# EAGLE design H0FR8 (EAGLE 9.6.1)

## Sheet 1 of 2
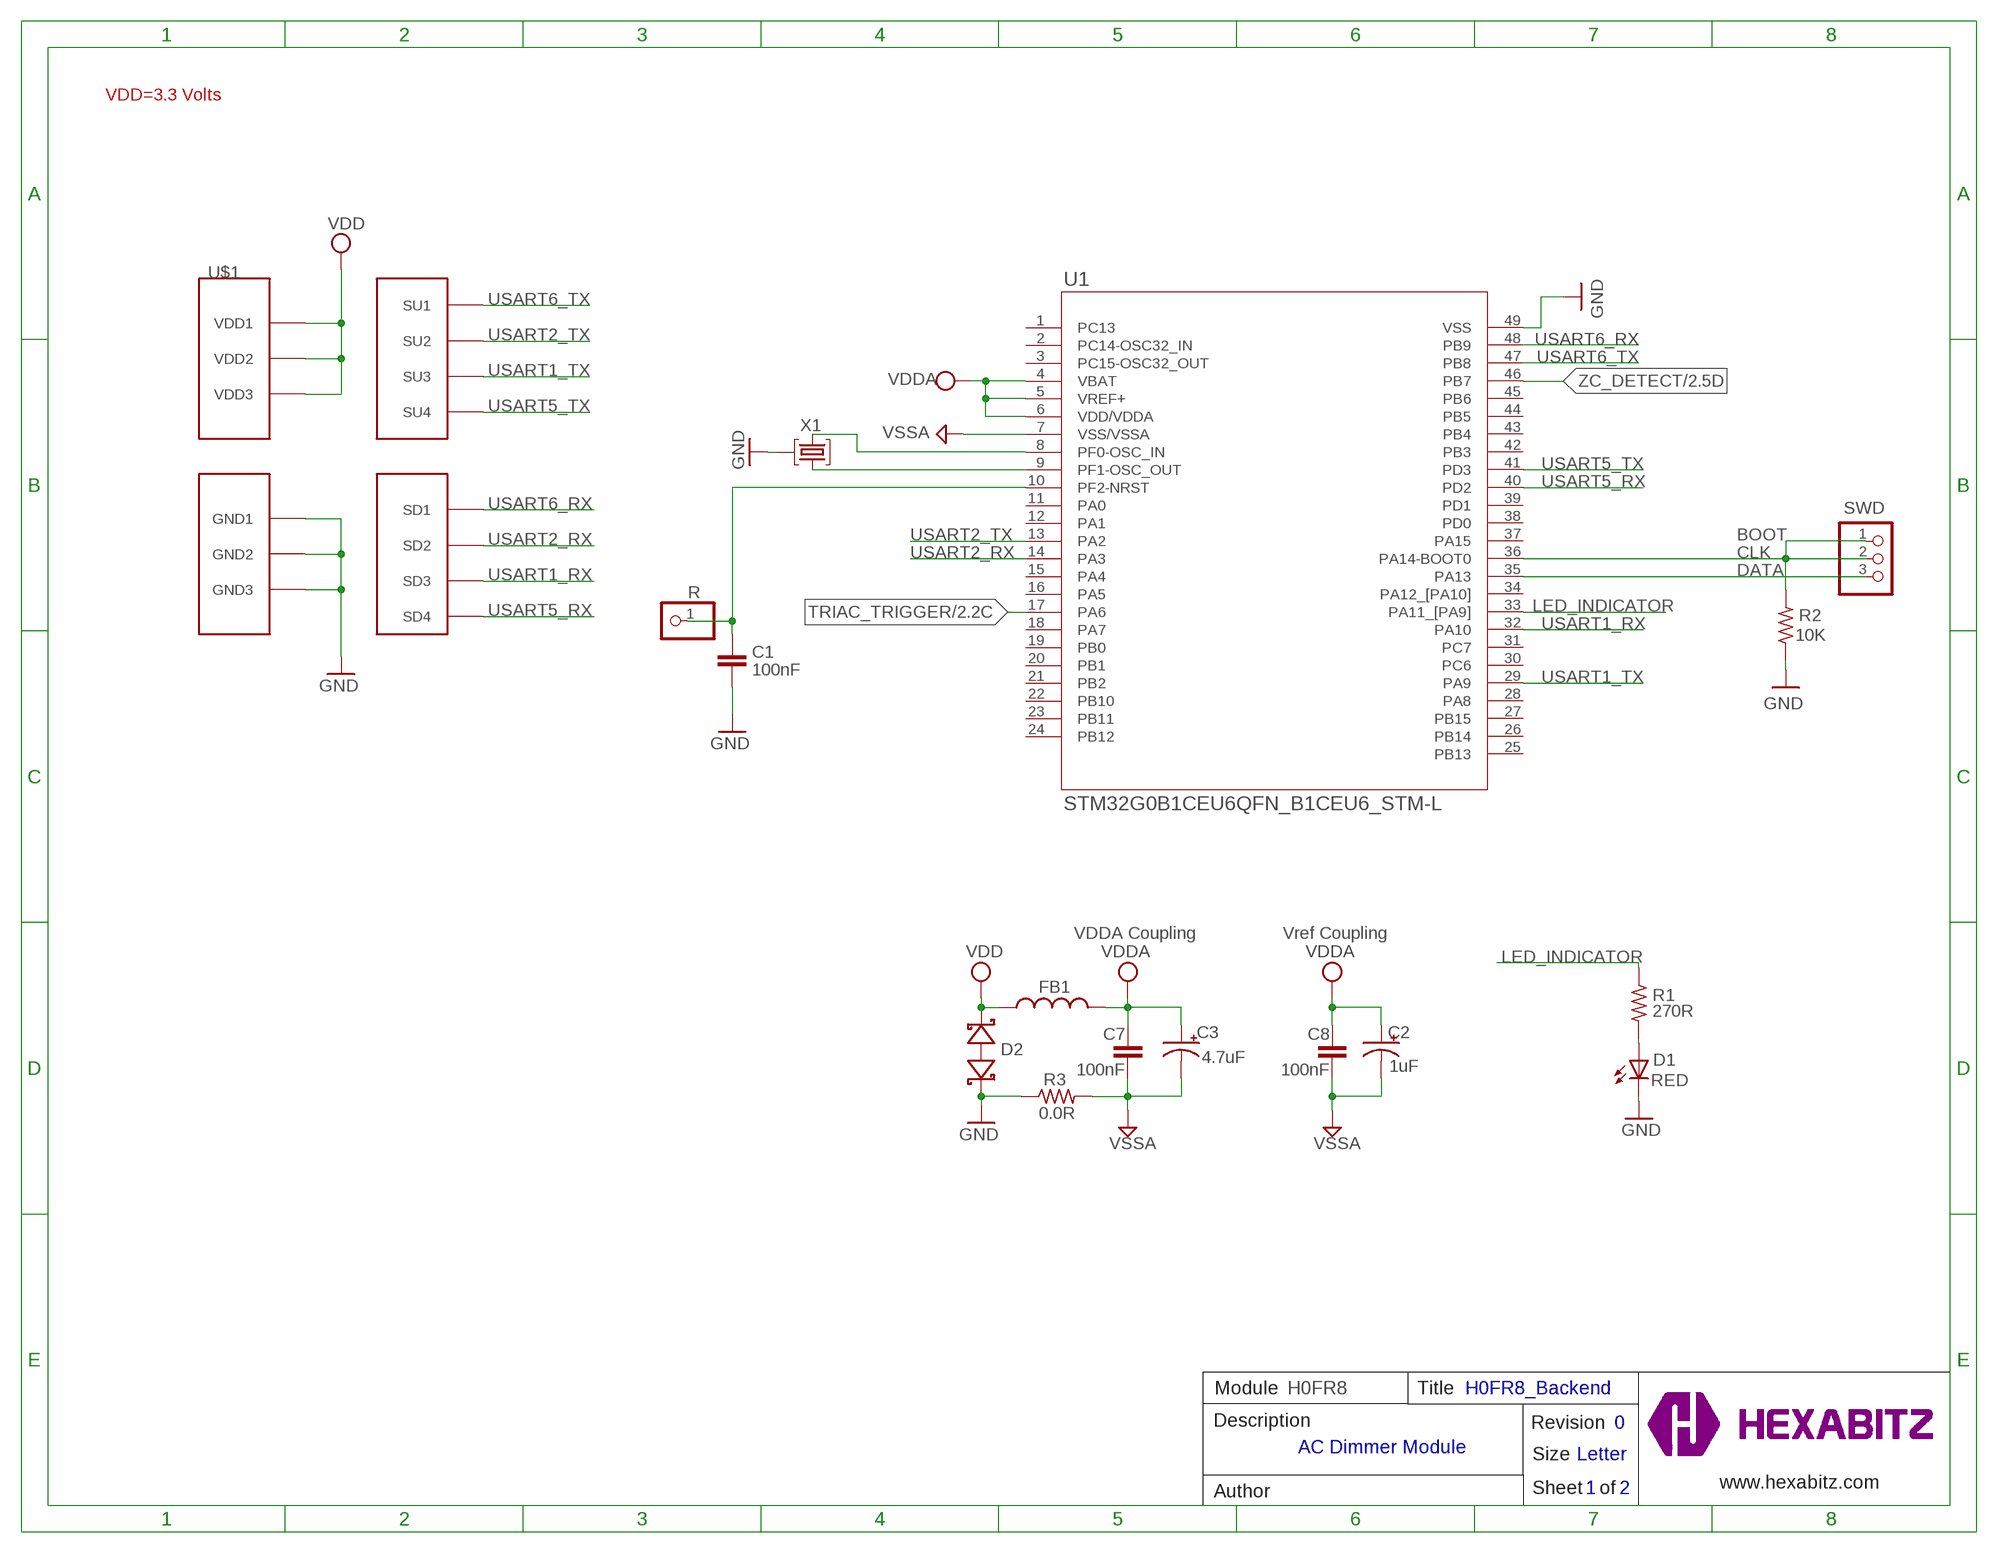
[diagram p0: schematic, sheet 1]

### Parts
C1  100nF  C-0603  [C-0603]
C2  1uF  C-0805-POL  [C-0805-POL]
C3  4.7uF  C-0805-POL  [C-0805-POL]
C7  100nF  C-0603  [C-0603]
C8  100nF  C-0603  [C-0603]
D1  RED  VLMS1300-GS08  [VLMS1300-GS08]
D2  BOURNS_CDSOD323-T03SCBOURNS_CDSOD323-T03SC_0_0  [BOURNS_CDSOD323-T03SC_0]
FB1  FB-0603  [FB-0603]
R  R  PINHD-1X1  [1X01]
R1  270R  R-0603  [R-0603]
R2  10K  R-0603  [R-0603]
R3  0.0R  R-0603  [R-0603]
SWD  PINHD-1X3  [1X03]
TRIMBLE-LOGO2  HEXA-LOGO  [HEXA-LOGO]
U1  STM32G0B1CEU6QFN_B1CEU6_STM-L  [QFN_B1CEU6_STM-L]
U$1  HEXABIT_17.32_X3_NO_P1_P2_P3_P4_P5_P6_P11_P12  [HEXABIT_17.32_X3_NO_P1_P2_P3_P4_P5_P6_P11_P12]
X1  XTALL_CSTCE8M00G52  [XTALL_CSTCE8M00G52]

### Nets
CLK: R2.2 SWD.1 SWD.2 U1.36(PA14-BOOT0)
DATA: SWD.3 U1.35(PA13)
GND: C1.2 D1.C D2.2(C) R2.1 R3.1 U1.49(VSS) U$1.PAD_PD12(GND1) U$1.PAD_PD17(GND2) U$1.PAD_PD19(GND3) X1.P$2 ; also sheet 2
LED_INDICATOR: R1.1 U1.33(PA11_[PA9])
N$1: D1.A R1.2
N$2: C1.1 R.1 U1.10(PF2-NRST)
N$5: U1.9(PF1-OSC_OUT) X1.P$1
N$6: U1.8(PF0-OSC_IN) X1.P$3
TRIAC_TRIGGER: U1.17(PA6) ; also sheet 2
USART1_RX: U1.32(PA10) U$1.PAD_PD2(SD3)
USART1_TX: U1.29(PA9) U$1.PAD_PU2(SU3)
USART2_RX: U1.14(PA3) U$1.PAD_PD1(SD2)
USART2_TX: U1.13(PA2) U$1.PAD_PU1(SU2)
USART5_RX: U1.40(PD2) U$1.PAD_PD8(SD4)
USART5_TX: U1.41(PD3) U$1.PAD_PU8(SU4)
USART6_RX: U1.48(PB9) U$1.PAD_PD3(SD1)
USART6_TX: U1.47(PB8) U$1.PAD_PU3(SU1)
VDD: D2.1(A) FB1.1 U$1.PAD_PU12(VDD1) U$1.PAD_PU17(VDD2) U$1.PAD_PU19(VDD3) ; also sheet 2
VDDA: C2.1(+) C3.1(+) C7.1 C8.1 FB1.2 U1.4(VBAT) U1.5(VREF+) U1.6(VDD/VDDA)
VSSA: C2.2(-) C3.2(-) C7.2 C8.2 R3.2 U1.7(VSS/VSSA)
ZC_DETECT: U1.46(PB7) ; also sheet 2
Unconnected: U1.1(PC13) U1.2(PC14-OSC32_IN) U1.3(PC15-OSC32_OUT) U1.11(PA0) U1.12(PA1) U1.15(PA4) U1.16(PA5) U1.18(PA7) U1.19(PB0) U1.20(PB1) U1.21(PB2) U1.22(PB10) U1.23(PB11) U1.24(PB12) U1.25(PB13) U1.26(PB14) U1.27(PB15) U1.28(PA8) U1.30(PC6) U1.31(PC7) U1.34(PA12_[PA10]) U1.37(PA15) U1.38(PD0) U1.39(PD1) U1.42(PB3) U1.43(PB4) U1.44(PB5) U1.45(PB6)

### Notes on the sheet
- VDD=3.3 Volts
- BOOT
- VDDA Coupling | Vref Coupling
- Module | H0FR8 | Title | H0FR8_Backend
- Description | Revision | 0
- AC Dimmer Module
- Size | Letter
- www.hexabitz.com
- Author | Sheet   of | 1 | 2
- C:/Users/Admin/Desktop/logodraft.bmp

## Sheet 2 of 2
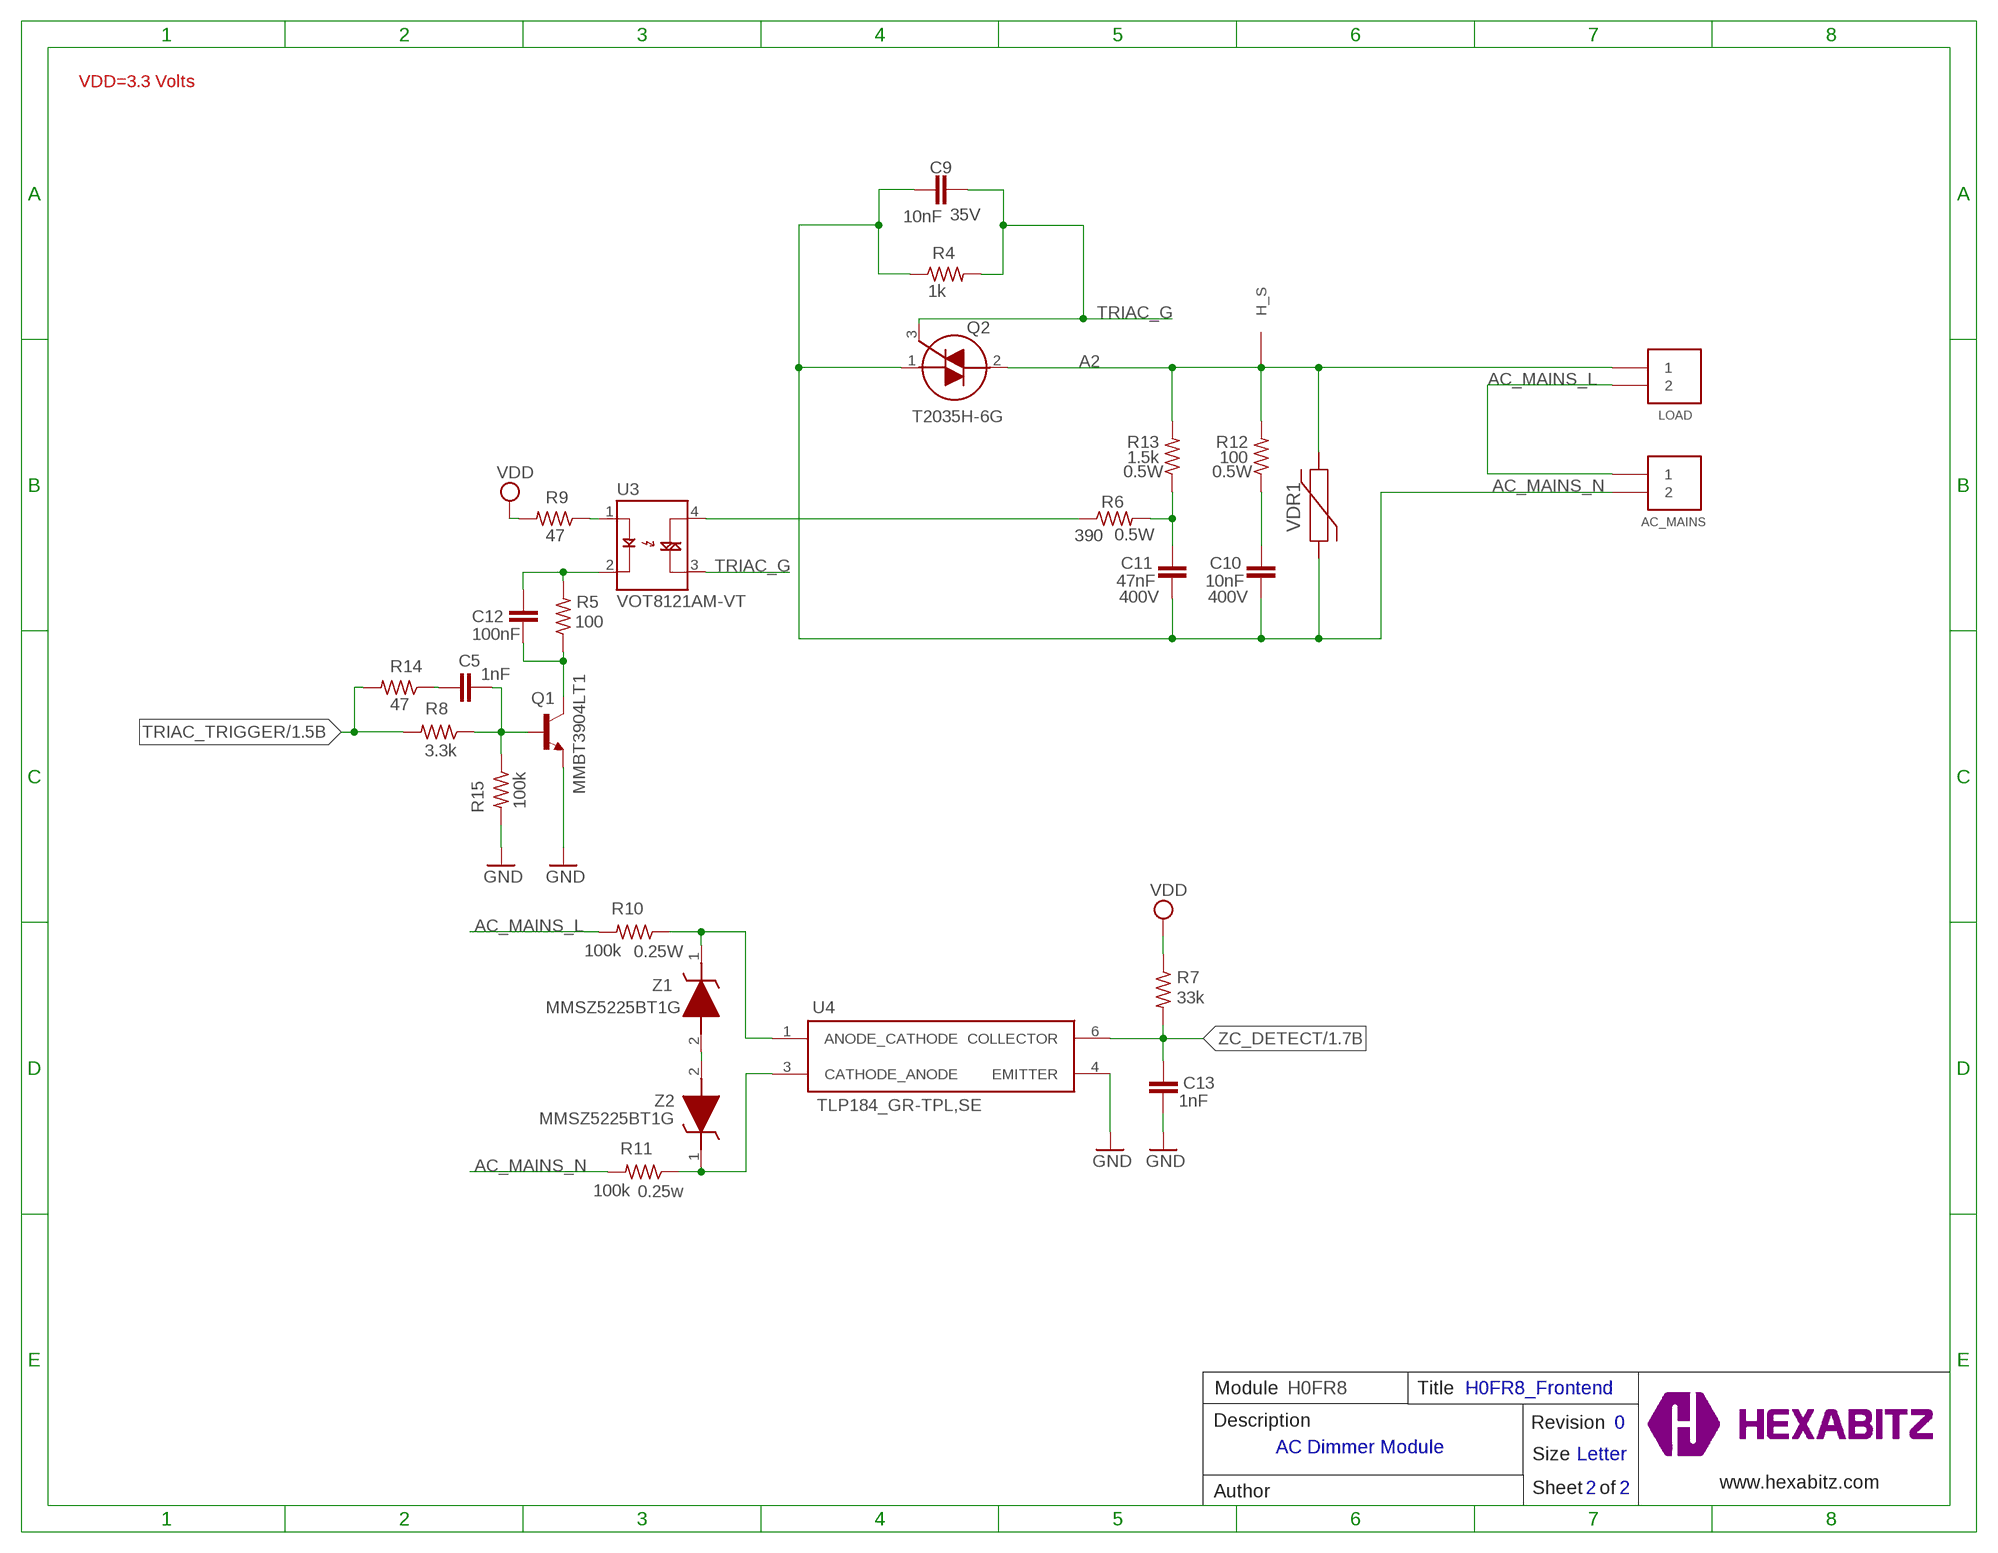
[diagram p1: schematic, sheet 2]

### Parts
AC_MAINS  1546111-2  [1546111-2]
C5  1nF  C-0603  [C-0603]
C9  10nF  C-0603  [C-0603]
C10  10nF  C-0805  [C-0805]
C11  47nF  C-0805  [C-0805]
C12  100nF  C-0603  [C-0603]
C13  1nF  C-0603  [C-0603]
LOAD  1546111-2  [1546111-2]
Q1  MMBT3904LT1  [MMBT3904LT1]
Q2  T2035H-6G  [T2035H6G]
R4  1k  R-0603  [R-0603]
R5  100  R-0603  [R-0603]
R6  390  R-0805  [R-0805]
R7  33k  R-0603  [R-0603]
R8  3.3k  R-0603  [R-0603]
R9  47  R-0603  [R-0603]
R10  100k  R-0805  [R-0805]
R11  100k  R-0805  [R-0805]
R12  100  R-0805  [R-0805]
R13  1.5k  R-0805  [R-0805]
R14  47  R-0603  [R-0603]
R15  100k  R-0603  [R-0603]
U3  VOT8121AM-VT  [SOIC254P675X240-4N]
U4  TLP184_GR-TPL,SE  [SOIC254P700X230-4N]
U$2  FK244D2PAK  [FK244D2PAK]
VDR1  V275LA4P  [LA_07MM_LOW_LTF]
Z1  MMSZ5225BT1G  [SOD3716X135N]
Z2  MMSZ5225BT1G  [SOD3716X135N]

### Nets
A2 [AC]: LOAD.1 Q2.2(MT2) R12.2 R13.2 U$2.P$1(H_S) U$2.P$2(H_S) VDR1.2
AC_MAINS_L [AC]: AC_MAINS.1 LOAD.2 R10.2
AC_MAINS_N [AC]: AC_MAINS.2 C9.2 C10.2 C11.2 Q2.1(MT1) R4.1 R11.2 VDR1.1
GND: C13.2 Q1.2(E) R15.2 U4.4(EMITTER) ; also sheet 1
N$3: R9.1 U3.1(A)
N$4: C10.1 R12.1
N$7: C11.1 R6.2 R13.1
N$8: R6.1 U3.4(MT2)
N$9: C5.2 R14.1
N$10: C12.1 R5.2 U3.2(C)
N$11: C12.2 Q1.3(C) R5.1
N$12: Z1.2(A) Z2.2(A)
N$13: C5.1 Q1.1(B) R8.1 R15.1
N$15: R10.1 U4.1(ANODE_CATHODE) Z1.1(K)
N$16: R11.1 U4.3(CATHODE_ANODE) Z2.1(K)
TRIAC_G: C9.1 Q2.3(G) R4.2 U3.3(MT1)
TRIAC_TRIGGER: R8.2 R14.2 ; also sheet 1
VDD: R7.1 R9.2 ; also sheet 1
ZC_DETECT: C13.1 R7.2 U4.6(COLLECTOR) ; also sheet 1

### Notes on the sheet
- VDD=3.3 Volts
- Module | H0FR8 | Title | H0FR8_Frontend
- Description | Revision | 0
- AC Dimmer Module
- Size | Letter
- www.hexabitz.com
- Author | Sheet   of | 2 | 2

## Library data of the parts
AC_MAINS LOAD = HEXABITZ_CONNECTION_PARTS:1546111-2: Conn Shrouded Header HDR 2 POS 5.08mm Solder ST Thru-Hole; MFN: TE Connectivity; MPN: 1546111-2; OCTOPART_URL: https://octopart.com/1546111-2-te+connectivity-40393355
C1 C5 C7 C8 C12 C13 = HEXABITZ_RCLS:C-0603: CAP CER 10% X7R 0603
C2 = HEXABITZ_RCLS:C-0805-POL: Cap Tant Solid SMD 2012; CAPACITANCE: 1.00uF; MFN: Yageo; MPN: CC0805KKX7R7BB105; OCTOPART_URL: https://octopart.com/cc0805kkx7r7bb105-yageo-8376555?r=sp&s=YKl1wwtkROau_X5nniH2ig; TOLERANCE: 10%; VOLTAGE_RATING: 16V
C3 = HEXABITZ_RCLS:C-0805-POL: Cap Tant Solid SMD 2012; CAPACITANCE: 4.7uF; MFN: Murata; MPN: GRM21BC81E475KA12L; OCTOPART_URL: https://octopart.com/grm21bc81e475ka12l-murata-10331911?r=sp&s=RY3qZSD8T6mG6TC9CHI5qQ; TOLERANCE: 10%; VOLTAGE_RATING: 25V
C9 = HEXABITZ_RCLS:C-0603: CAP CER 10% X7R 0603; VOLTAGE_RATING: 35V
C10 = HEXABITZ_RCLS:C-0805: CAP CER 10% X7R 0805; MPN: C2012X7T2W103M085AA; VOLTAGE_RATING: 400V
C11 = HEXABITZ_RCLS:C-0805: CAP CER 10% X7R 0805; MPN: C2012X7T2W473K125AA; VOLTAGE_RATING: 400V
D1 = HEXABITZ_USER_INTERFACE_PARTS:VLMS1300-GS08: Red 0603 130° Clear 54 mcd 2 V Surface Mount ChipLED ; Octopart Url : http://octopart.com/vlms1300-gs08-vishay-21709201; MFN: Vishay; MPN: VLMS1300-GS08; OCTOPART_URL: https://octopart.com/vlms1300-gs08-vishay-21709201?r=sp&s=_gcP4_q8T1SC6PJQPTQ9yA
D2 = HEXABITZ_RCLS:BOURNS_CDSOD323-T03SC: CDSOD323-TxxSC - TVS Diode Series; DESCRIPTION: Dio Tvs Vwm 03V 500W Bidir Sod323 / Tape & Reel - 7" Reel; MFN: Bourns; MPN: CDSOD323-T03SC; OCTOPART_URL: https://octopart.com/cdsod323-t03sc-bourns-10487153?r=sp
FB1 = HEXABITZ_RCLS:FB-0603: Ferrite Beads Multi-Layer 0603
Q1 = HEXABITZ_RCLS:MMBT3904LT1: TRANS NPN 40V 0.2A SOT23; MFN: ON Semiconductor; MOUNTING_STYLE: Surface Mount; MPN: MMBT3904LT1G; NUM_OF_PINS: 3; OCTOPART_ID: 0bb6c2bc2200d471; OCTOPART_URL: http://octopart.com/mmbt3904lt1g-on+semiconductor-3280; PACKAGE: SOT-23-3; PACKAGING: Reel; POLARITY: NPN; POWER_DISSIPATION: 0.225 W; PRODUCT_CATEGORY: Transistors Bipolar-BJT; SERIES: MMBT3904L; VOLTAGE_RATING_DC: 40.0 V
Q2 = HEXABITZ_ICs:T2035H-6G: TRIAC 600V 210A 3-Pin(2+Tab) D2PAK Tube Source: Datasheet <https://www.st.com/resource/en/datasheet/t2035h-6g.pdf>; DESCRIPTION: TRIAC 600V 210A 3-Pin(2+Tab) D2PAK Tube; HEIGHT: 4.83mm; MANUFACTURER_NAME: STMicroelectronics; MANUFACTURER_PART_NUMBER: T2035H-6G; MOUSER_PART_NUMBER: 511-T2035H-6G; MOUSER_PRICE-STOCK: https://www.mouser.co.uk/ProductDetail/STMicroelectronics/T2035H-6G?qs=gNDSiZmRJS8hxiVy%2FAHP7g%3D%3D
R = HEXABITZ_USER_INTERFACE_PARTS:PINHD-1X1: PIN HEADER; MFN: TE Connectivity; MPN: 87227-1; OCTOPART_URL: https://octopart.com/87227-1-te+connectivity-39512052?r=sp
R1-R4 = HEXABITZ_RCLS:R-0603: Thick Film Resistors - SMD 0603
R5 R7 R9 R14 = HEXABITZ_RCLS:R-0603: Thick Film Resistors - SMD 0603; MFN: Yageo; MPN: RC0402FR-07100RL; OCTOPART_URL: https://octopart.com/crcw0603110rfkea-vishay-39455532; RESISTANCE: 110.0 Ω; TOLERANCE: ±1%
R6 = HEXABITZ_RCLS:R-0805: Thick Film Resistors - SMD 0605; MPN: ERJ-P06J391V; POWER: 0.5W
R8 R15 = HEXABITZ_RCLS:R-0603: Thick Film Resistors - SMD 0603; MFN: Yageo; MPN: RC0603JR-070RL; OCTOPART_URL: https://octopart.com/crcw06032k40jnea-vishay-40298967; RESISTANCE: 2400.0 Ω; TOLERANCE: ±5%
R10 = HEXABITZ_RCLS:R-0805: Thick Film Resistors - SMD 0605; MFN: Yageo; MPN: RC0603JR-070RL; OCTOPART_URL: https://octopart.com/crcw06032k40jnea-vishay-40298967; POWER: 0.25W; RESISTANCE: 2400.0 Ω; TOLERANCE: ±5%
R11 = HEXABITZ_RCLS:R-0805: Thick Film Resistors - SMD 0605; MPN: ERJ-P06J104V; POWER: 0.25w
R12 = HEXABITZ_RCLS:R-0805: Thick Film Resistors - SMD 0605; MPN: ERJ-P06J101V; POWER: 0.5W
R13 = HEXABITZ_RCLS:R-0805: Thick Film Resistors - SMD 0605; MPN: ERJ-P06J152V; POWER: 0.5W
SWD = HEXABITZ_CONNECTION_PARTS:PINHD-1X3: PIN HEADER
TRIMBLE-LOGO2 = HEXABITZ_USER_INTERFACE_PARTS:HEXA-LOGO: Trimble-Logo
U1 = HEXABITZ_ICs:STM32G0B1CEU6; COPYRIGHT: Copyright (C) 2021 Ultra Librarian. All rights reserved.; MANUFACTURER_PART_NUMBER: STM32G0B1CEU6; MFR_NAME: STMicroelectronics
U3 = HEXABITZ_ICs:VOT8121AM-VT: VOT8121AM-VT Check availability <https://pricing.snapeda.com/parts/VOT8121AM-VT/Vishay%20Semiconductor%20Opto%20Division/view-part?ref=eda>; AVAILABILITY: In Stock; CHECK_PRICES: https://www.snapeda.com/parts/VOT8121AM-VT/Vishay+Semiconductor+Opto+Division/view-part/?ref=eda; DESCRIPTION: Optoisolator Triac Output 3750Vrms 1 Channel 4-SOP; MF: Vishay Semiconductor Opto Division; MP: VOT8121AM-VT; PACKAGE: SMD-4 Vishay Semiconductor Opto Division; PRICE: None; SNAPEDA_LINK: https://www.snapeda.com/parts/VOT8121AM-VT/Vishay+Semiconductor+Opto+Division/view-part/?ref=snap
U4 = HEXABITZ_ICs:TLP184_GR-TPL,SE: Transistor Output Optocouplers 50mA Photocoupler 80V 50mA 3750Vrms Source: Datasheet <https://toshiba.semicon-storage.com/info/docget.jsp?did=14118&prodName=TLP184(SE>
U$1 = hexabitz_connectors:HEXABIT_17.32_X3_NO_P1_P2_P3_P4_P5_P6_P11_P12
U$2 = HEXABITZ_OTHER_PARTS:FK244D2PAK
VDR1 = HEXABITZ_RCLS:V275LA4P; COPYRIGHT: Copyright (C) 2024 Ultra Librarian. All rights reserved.; MANUFACTURER_PART_NUMBER: V275LA4P; MFR_NAME: Littelfuse Inc
X1 = Hexabitz:XTALL_CSTCE8M00G52: MURATA CSTCE8M00G52-R0 RESONATOR, SMD, 8MHZ ; Octopart Url : https://octopart.com/cstce8m00g52-r0-murata-7145559; MFN: Murata; MPN: CSTCE8M00G52Z-R0; OCTOPART_URL: https://octopart.com/cstce8m00g52z-r0-murata-17755941?r=sp&s=JDnNJnrHQhyS8Zk4ofFWXw
Z1 Z2 = HEXABITZ_RCLS:MMSZ5225BT1G: Zener Diode 500 mW SOD-123 Source: Datasheet <http://www.onsemi.com/pub/Collateral/MMSZ5221BT1-D.PDF>; ARROW_PART_NUMBER: MMSZ5225BT1G; ARROW_PRICE-STOCK: https://www.arrow.com/en/products/mmsz5225bt1g/on-semiconductor?region=nac; DESCRIPTION: Zener Diode 500 mW SOD-123; HEIGHT: 1.35mm; MANUFACTURER_NAME: onsemi; MANUFACTURER_PART_NUMBER: MMSZ5225BT1G; MOUSER_PART_NUMBER: 863-MMSZ5225BT1G; MOUSER_PRICE-STOCK: https://www.mouser.co.uk/ProductDetail/onsemi/MMSZ5225BT1G?qs=P4IOph%252Bbot9HKjr%2F4KMXOA%3D%3D

## Net classes
1 AC: clearance 1.016 mm

## Board
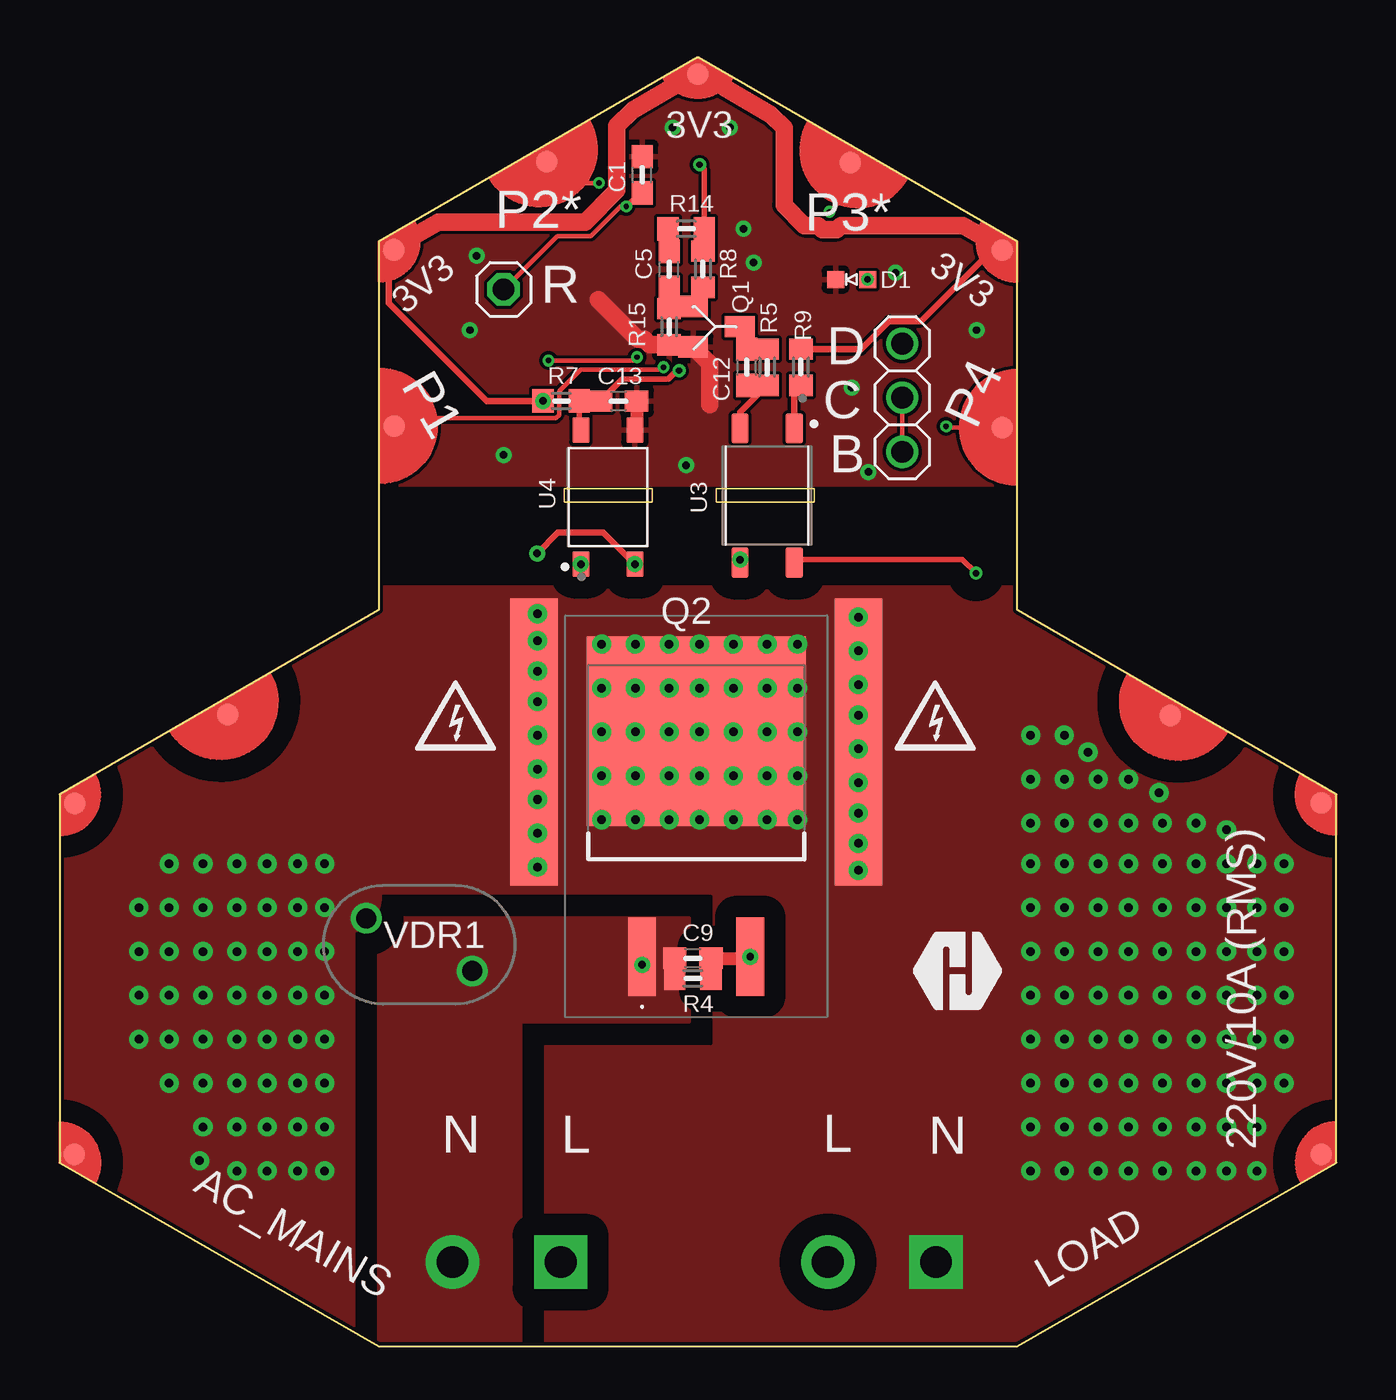
[diagram p2: board, top side]
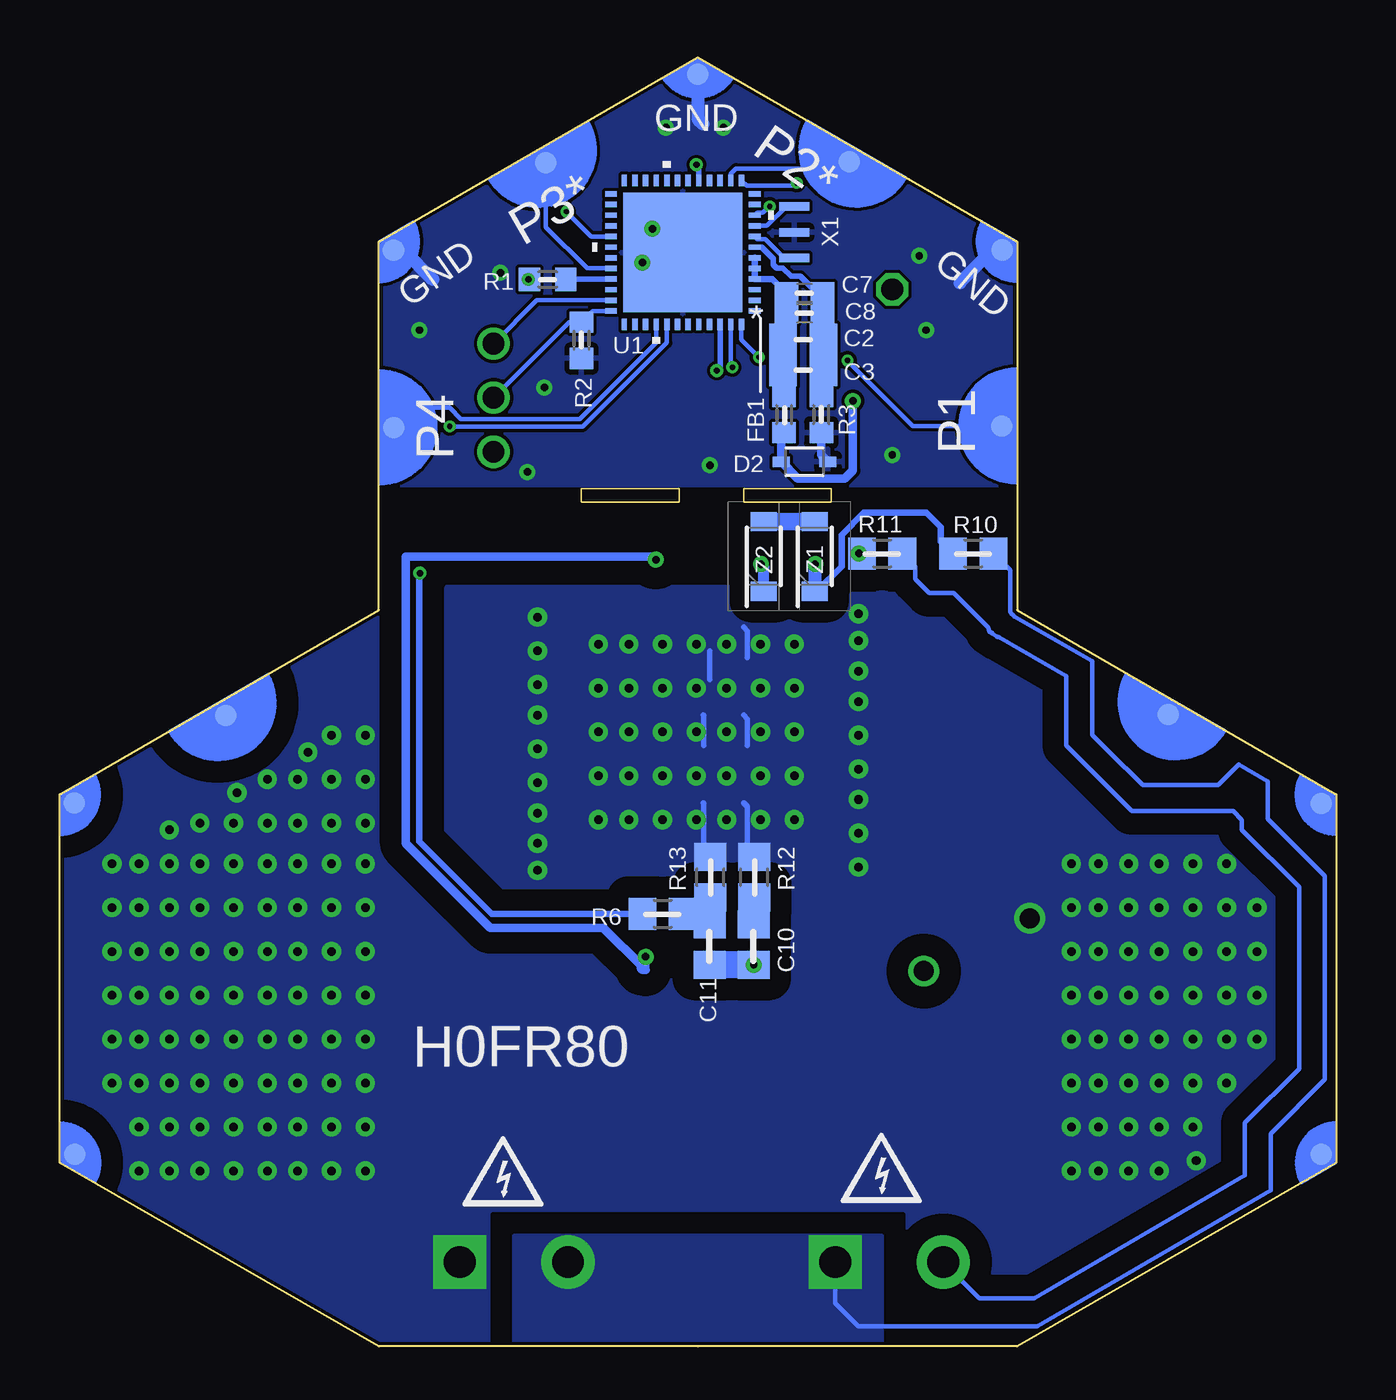
[diagram p3: board, bottom side, seen from below]

Size 60 x 60.6 mm. Coordinates in mm from the lower left corner, seen from the top.
Copper layers (1*16): Top 0.035mm / dielectric 1.5mm / Bottom 0.035mm
Design rules "2_layer *": minimum track width 7mil, minimum drill 0.2mm, track to track 6mil, track to pad 6mil, pad to pad 6mil, via to via 6mil, smd to smd 0mil, copper to edge 0.15mm, drill to drill 8mil, minimum pad ring 10mil, minimum via ring 6mil, stop-mask expansion 2mil, vias tented up to drill 16mil, thermal gap 10mil
Milling: 8 lines

### Footprints (pad centres in the part's own frame; a part is rotated, then mirrored left to right if it is on the bottom)
1546111-2 = drill 1.5 pad 2.5 square: 1 -2.54,0 | drill 1.5 pad 2.5: 2 2.54,0
C-0603 = smd 1.1 x 1: 1 -0.85,0; 2 0.85,0
C-0805-POL = smd 1.3 x 1.5: 1 -0.95,0; 2 0.95,0
C-0805 = smd 1.3 x 1.5: 1 -0.95,0; 2 0.95,0
VLMS1300-GS08 = smd 0.8 x 0.8: A 0,0.75; C 0,-0.75
BOURNS_CDSOD323-T03SC_0 = smd 0.8 x 0.5: 1 -1.1,0; 2 1.1,0
FB-0603 = smd 1 x 1.1: 1 -0.85,0; 2 0.85,0
MMBT3904LT1 = smd 1 x 1.4: 1 -0.95,-1.1; 2 0.95,-1.1; 3 0,1.1
T2035H6G = smd 3.7 x 1.3: 1 6.6,-2.54; 3 6.6,2.54 | smd 8.9 x 10.3: 2 -4,0
1X01 = drill 1.016 octagon: 1 0,0
R-0603 = smd 1 x 1.1: 1 -0.85,0; 2 0.85,0
R-0805 = smd 1.3 x 1.5: 1 -0.95,0; 2 0.95,0
1X03 = drill 1.016: 1 -2.54,0; 2 0,0; 3 2.54,0
QFN_B1CEU6_STM-L = smd 0.55 x 0.254: 1 -3.38,2.751; 2 -3.38,2.251; 3 -3.38,1.75; 4 -3.38,1.25; 5 -3.38,0.75; 6 -3.38,0.25; 7 -3.38,-0.25; 8 -3.38,-0.75; 9 -3.38,-1.25; 10 -3.38,-1.75; 11 -3.38,-2.251; 12 -3.38,-2.751; 25 3.38,-2.751; 26 3.38,-2.251; 27 3.38,-1.75; 28 3.38,-1.25; 29 3.38,-0.75; 30 3.38,-0.25; 31 3.38,0.25; 32 3.38,0.75; 33 3.38,1.25; 34 3.38,1.75; 35 3.38,2.251; 36 3.38,2.751 | smd 0.254 x 0.55: 13 -2.751,-3.38; 14 -2.251,-3.38; 15 -1.75,-3.38; 16 -1.25,-3.38; 17 -0.75,-3.38; 18 -0.25,-3.38; 19 0.25,-3.38; 20 0.75,-3.38; 21 1.25,-3.38; 22 1.75,-3.38; 23 2.251,-3.38; 24 2.751,-3.38; 37 2.751,3.38; 38 2.251,3.38; 39 1.75,3.38; 40 1.25,3.38; 41 0.75,3.38; 42 0.25,3.38; 43 -0.25,3.38; 44 -0.75,3.38; 45 -1.25,3.38; 46 -1.75,3.38; 47 -2.251,3.38; 48 -2.751,3.38 | smd 5.6 x 5.6: 49 0,0
SOIC254P675X240-4N = smd 1.4 x 0.8: 1 -3.15,1.27; 2 -3.15,-1.27; 3 3.15,-1.27; 4 3.15,1.27
SOIC254P700X230-4N = smd 1.2 x 0.8: 1 -3.15,1.27; 3 -3.15,-1.27; 4 3.15,-1.27; 6 3.15,1.27
HEXABIT_17.32_X3_NO_P1_P2_P3_P4_P5_P6_P11_P12 = smd 1 x 1 bottom: PAD_PD1 -6.86,25.69; PAD_PD2 7.39,25.65; PAD_PD6 -21.865,-0.296; PAD_PD12 0.24,29.8 | smd 1 x 1 rotated 150 bottom: PAD_PD3 -14.037,13.278; PAD_PD5 -29.057,-4.464; PAD_PD8 14.542,13.204 | smd 1 x 1 rotated 30 bottom: PAD_PD7 -29.06,-20.97; PAD_PD13 22.432,-0.341 | smd 1 x 1 rotated 330 bottom: PAD_PD9 29.539,-20.961; PAD_PD17 -14.056,21.551 | smd 1 x 1 rotated 210 bottom: PAD_PD11 29.543,-4.456; PAD_PD19 14.55,21.537 | smd 1 x 1: PAD_PU1 -6.86,25.69; PAD_PU2 7.39,25.65; PAD_PU6 -21.865,-0.296; PAD_PU12 0.24,29.8 | smd 1 x 1 rotated 150: PAD_PU3 -14.037,13.278; PAD_PU5 -29.057,-4.464; PAD_PU8 14.542,13.204 | smd 1 x 1 rotated 30: PAD_PU7 -29.06,-20.97; PAD_PU13 22.432,-0.341 | smd 1 x 1 rotated 330: PAD_PU9 29.539,-20.961; PAD_PU17 -14.056,21.551 | smd 1 x 1 rotated 210: PAD_PU11 29.543,-4.456; PAD_PU19 14.55,21.537
FK244D2PAK = smd 2.25 x 13.5: P$1 0,0; P$2 15.25,0
LA_07MM_LOW_LTF = drill 0.94 pad 1.448: 1 -2.489,1.245; 2 2.489,-1.245
XTALL_CSTCE8M00G52 = smd 1.4 x 0.4: P$1 0,1.2; P$2 0,0; P$3 0,-1.2
SOD3716X135N = smd 0.91 x 1.22: 1 -1.635,0; 2 1.635,0

### Placement (x,y rotation side)
AC_MAINS  21.01,3.96 180 top
C1  27.38,55.08 90 top
C2  25.05,47.32 0 bottom
C3  25.05,45.89 0 bottom
C5  28.65,50.63 90 top
C7  25,49.52 0 bottom
C8  25,48.57 0 bottom
C9  29.76,18.25 180 top
C10  27.38,18.88 270 bottom
C11  29.44,18.88 270 bottom
C12  32.3,46.03 90 top
C13  26.27,44.44 0 top
D1  37.22,50.16 270 top
D2  25,41.58 0 bottom
FB1  25.95,43.81 90 bottom
LOAD  38.65,3.96 180 top
Q1  30.87,47.93 270 top
Q2  29.92,24.92 270 top
R  20.87,49.68 0 top
R1  37.06,50.16 180 bottom
R2  35.48,47.3 90 bottom
R3  24.2,43.81 90 bottom
R4  29.76,17.3 0 top
R5  33.25,46.03 270 top
R6  31.66,20.33 0 bottom
R7  23.57,44.44 0 top
R8  30.24,50.63 90 top
R9  34.84,46.03 90 top
R10  17.06,37.28 0 bottom
R11  21.35,37.28 0 bottom
R12  27.36,22.06 90 bottom
R13  29.42,22.06 90 bottom
R14  29.44,52.54 0 top
R15  28.65,47.93 270 top
SWD  39.6,44.6 90 top
TRIMBLE-LOGO2  42.21,15.8 0 top
U1  30.71,51.43 180 bottom
U3  33.25,40 270 top
U4  25.77,39.92 90 top
U$1  29.76,30 0 top
U$2  22.3,28.41 0 top
VDR1  16.9,18.88 180 top
X1  25.47,52.38 0 bottom
Z1  24.52,37.14 90 bottom
Z2  26.9,37.14 90 bottom

### Tracks (layer width: path | path; a pad name or v marks a point on that pad's centre or on a via)
A2  (via drill 0.4 pad 0.9)
  Bottom 0.254: R13.2 29.74,23.32 29.74,25.53 29.76,25.55 | R12.2 27.67,23.32 27.67,25.37 27.85,25.55 | 29.74,28.24 29.74,29.66 29.76,29.68 | 27.67,28.24 27.67,29.5 27.85,29.68 | 29.44,31.34 29.44,32.69 | 27.67,32.37 27.67,33.62 27.85,33.81
  other vias: 37.54,34.28 37.54,32.69 37.54,31.11 37.54,29.68 37.54,28.09 37.54,26.5 37.54,25.07 37.54,23.65 37.54,22.38 22.46,22.53 22.46,24.12 22.46,25.71 22.46,27.14 22.46,28.73 22.46,30.31 22.46,31.74 22.46,33.17 22.46,34.44 45.64,22.69 47.22,22.69 48.81,22.69 50.24,22.69 51.83,22.69 53.41,22.69 54.84,22.69 56.27,22.69 57.54,22.69 45.64,20.63 47.22,20.63 48.81,20.63 50.24,20.63 51.83,20.63 53.41,20.63 54.84,20.63 56.27,20.63 57.54,20.63 45.64,18.57 47.22,18.57 48.81,18.57 50.24,18.57 51.83,18.57 53.41,18.57 54.84,18.57 56.27,18.57 57.54,18.57 45.64,16.5 47.22,16.5 48.81,16.5 50.24,16.5 51.83,16.5 53.41,16.5 54.84,16.5 56.27,16.5 57.54,16.5 45.64,14.44 47.22,14.44 48.81,14.44 50.24,14.44 51.83,14.44 53.41,14.44 54.84,14.44 56.27,14.44 57.54,14.44 45.64,12.37 47.22,12.37 48.81,12.37 50.24,12.37 51.83,12.37 53.41,12.37 54.84,12.37 56.27,12.37 57.54,12.37 45.64,10.31 47.22,10.31 48.81,10.31 50.24,10.31 51.83,10.31 53.41,10.31 54.84,10.31 56.27,10.31 45.64,8.25 47.22,8.25 48.81,8.25 50.24,8.25 51.83,8.25 53.41,8.25 54.84,8.25 56.27,8.25 45.64,28.73 47.22,28.73 45.64,26.66 47.22,26.66 48.81,26.66 50.24,26.66 45.64,24.6 47.22,24.6 48.81,24.6 50.24,24.6 51.83,24.6 53.41,24.6 54.84,24.28 51.67,26.03 48.33,27.93 25.47,26.82 27.06,26.82 28.65,26.82 30.08,26.82 31.67,26.82 33.25,26.82 34.68,26.82 25.47,24.76 27.06,24.76 28.65,24.76 30.08,24.76 31.67,24.76 33.25,24.76 34.68,24.76 25.47,30.95 27.06,30.95 28.65,30.95 30.08,30.95 31.67,30.95 33.25,30.95 34.68,30.95 25.47,28.88 27.06,28.88 28.65,28.88 30.08,28.88 31.67,28.88 33.25,28.88 34.68,28.88 25.47,33.01 27.06,33.01 28.65,33.01 30.08,33.01 31.67,33.01 33.25,33.01 34.68,33.01 5.15,22.69 6.74,22.69 8.33,22.69 9.76,22.69 11.19,22.69 12.46,22.69 3.73,20.63 5.15,20.63 6.74,20.63 8.33,20.63 9.76,20.63 11.19,20.63 12.46,20.63 3.73,18.57 5.15,18.57 6.74,18.57 8.33,18.57 9.76,18.57 11.19,18.57 12.46,18.57 3.73,16.5 5.15,16.5 6.74,16.5 8.33,16.5 9.76,16.5 11.19,16.5 12.46,16.5 3.73,14.44 5.15,14.44 6.74,14.44 8.33,14.44 9.76,14.44 11.19,14.44 12.46,14.44 5.15,12.37 6.74,12.37 8.33,12.37 9.76,12.37 11.19,12.37 12.46,12.37 6.74,10.31 8.33,10.31 9.76,10.31 11.19,10.31 12.46,10.31 6.58,8.72 8.33,8.25 9.76,8.25 11.19,8.25 12.46,8.25
  pour Bottom (rank 2, no thermals): 15,35.71 45,35.71 59.92,26.03 60.08,5.55 45.64,-3.02 5.15,-2.87 -7.55,12.69 -3.74,32.54
  pour Top (rank 2, no thermals): 15,35.71 45,35.71 59.92,26.03 60.08,5.55 45.64,-3.02 5.15,-2.87 -7.55,12.69 -3.74,32.54
AC_MAINS_L
  Bottom 0.203: R10.2 15.32,36.49 15.32,34.51 15.27,34.46 15.26,34.42 15.19,34.38 15.13,34.31 11.48,32.21 11.48,28.75 9.92,27.19 9.89,27.19 9.09,26.38 5.54,26.38 4.58,27.35 3.21,26.56 3.21,24.79 0.53,22.1 0.53,12.55 3.09,9.99 3.09,7.33 14.04,0.94 22.46,0.94 23.55,2.03 AC_MAINS.1
  pour Bottom (no thermals): 21.35,5.23 21.35,-0.01 38.65,-0.01 38.65,5.23
AC_MAINS_N  (via drill 0.35 pad 0.75)
  Top 1.27: C10.2 Q2.1
  Bottom 0.203: 12.7,31.5 12.7,28.24 9.62,25.16 4.84,25.16 4.43,24.76 4.43,24.28 1.75,21.6 1.75,13.05 4.31,10.5 4.31,8.03 14.19,2.27 16.77,2.27 AC_MAINS.2 | 12.7,31.5 | 12.7,31.5 15.87,33.34 15.91,33.34 15.95,33.38 16.17,33.51 16.18,33.54 16.31,33.61 16.35,33.78 17.98,35.41 19.13,35.41 19.78,36.06 19.78,36.66 R11.2
  Bottom 1.27: C10.2 C11.2
  other vias: 27.38,17.93
  pour Top (no thermals): 29.6,20.15 29.6,15.23 21.66,15.23 21.66,-0.01 15,-0.01 15,20.15
CLK
  Top 0.203: SWD.2 SWD.1
  Bottom 0.203: U1.36 34.95,48.68 R2.2 36.05,48.15 SWD.2
DATA
  Bottom 0.203: SWD.3 37.57,49.18 U1.35
GND  (via drill 0.35 pad 0.75)
  Top 0.61: C13.2 27.12,43.15 U4.4
  Top 0.813: 25.31,49.2 27.18,47.34 27.48,47.34 27.74,47.08 R15.2 28.75,46.98 Q1.2 30.55,46.2 30.55,44.28
  Bottom 0.305: U1.49 31.82,52.54 v32.14,52.54
  Bottom 0.406: D2.2 24.2,41.89 R3.1
  Bottom 0.61: U$1.PAD_PD12 30,57.7 29.76,57.46 | U$1.PAD_PD17 16.15,51.55 17.69,50 | U$1.PAD_PD19 43.84,51.53 42.46,50.16
  other vias: 32.62,50.95 39.29,50.47 43.09,47.78 19.28,47.78 19.6,51.27 20.87,41.9 29.44,41.43 38.02,41.11 37.22,45.08 28.81,57.3 31.51,57.3
  pour Top: 15,51.9 29.92,60.48 45,51.9 45,40.47 15,40.47
  pour Bottom: 15,51.9 29.92,60.48 45,51.9 45,40.47 15,40.47
LED_INDICATOR
  Bottom 0.254: U1.33 36.19,50.18 R1.1
N$1  (via drill 0.3 pad 0.6)
  Bottom 0.254: D1.A R1.2
  other vias: 37.97,50.16
N$2  (via drill 0.25 pad 0.55)
  Top 0.203: C1.1 27.26,54.23 v26.63,53.59 26.37,53.59 24.97,52.2 23.38,52.2 R.1
  Bottom 0.203: U1.10 27.21,53.3 26.95,53.3 26.66,53.59 v26.63,53.59
N$3
  Top 0.305: R9.1 34.52,44.86 U3.1 34.52,43.01
N$4
  Bottom 0.254: C10.1 27.36,19.86 R12.1
N$5
  Bottom 0.203: X1.P$1 25.86,53.58 26.76,52.68 U1.9
N$6
  Bottom 0.203: U1.8 27.21,52.06 26.84,52.06 25.96,51.18 X1.P$3
N$7
  Bottom 0.254: R13.1 29.44,21.08 29.44,19.99 | 29.44,19.99 C11.1 | R6.2 30.37,19.99 29.44,19.99
N$8  (via drill 0.3 pad 0.6)
  Top 0.254: 34.52,36.99 42.43,36.99 v43.07,36.35
  Top 0.61: U3.4 34.52,36.99
  Bottom 0.254: 43.09,36.32 v43.07,36.35
  Bottom 0.305: R6.1 39.7,20.33 43.09,23.73 43.09,36.32
N$9
  Top 0.305: R14.1 28.59,51.54 C5.2
N$10
  Top 0.305: 31.98,43.01 31.98,43.91 R5.2 C12.1
  Top 0.61: U3.2 31.98,43.01
N$11
  Top 0.305: Q1.3 32.3,47.61 32.3,46.98 | 32.3,46.98 C12.2 | R5.1 32.4,46.88 32.3,46.98
N$12
  Bottom 0.813: Z1.2 Z2.2
N$13
  Top 0.305: C5.1 R15.1 29.67,48.78 Q1.1 29.77,49.32 R8.1
N$15  (via drill 0.35 pad 0.75)
  Bottom 0.305: 23.25,36.66 23.25,38.15 22.21,39.19 19.26,39.19 18.58,38.51 18.58,37.84 R10.1 | 23.25,36.66 | 24.52,35.39 | 23.25,36.66 24.41,35.5 Z1.1
  Bottom 0.508: 24.52,35.39
  Bottom 0.61: U4.1 24.5,35.53 Z1.1 24.52,35.39
  other vias: 24.5,36.77
N$16  (via drill 0.35 pad 0.75)
  Top 0.305: v22.44,37.28 23.41,38.25 25.56,38.25 U4.3
  Bottom 0.305: R11.1 v22.44,37.28
  Bottom 0.508: 26.9,35.39 26.9,36.64 U4.3
  Bottom 0.61: Z2.1 26.9,35.39
  other vias: 27.04,36.77
TRIAC_G  (via drill 0.35 pad 0.75)
  Top 0.61: R4.2 C9.1 32.39,18.25 Q2.3 | U3.3 v31.98,36.99
  Bottom 0.406: 32.46,17.69 32.58,17.81 34.45,19.68 39.76,19.68 43.73,23.65 43.73,37.14 32.13,37.14 v31.98,36.99
  Bottom 0.61: 32.58,17.81 32.58,18.2 Q2.3
  other vias: 32.46,18.32
TRIAC_TRIGGER  (via drill 0.3 pad 0.6)
  Top 0.254: v30.08,55.55 30.29,55.34 R14.2
  Top 0.305: R14.2 30.24,52.48 R8.2
  Bottom 0.254: U1.17 29.96,55.44 v30.08,55.55
USART1_RX
  Bottom 0.203: U$1.PAD_PD2 37.15,52.63 35.2,50.68 U1.32
USART1_TX  (via drill 0.25 pad 0.55)
  Top 0.203: v36.18,53.34 37.15,54.31 U$1.PAD_PU2
  Bottom 0.203: U1.29 35.02,52.18 v36.18,53.34
USART2_RX
  Bottom 0.203: U$1.PAD_PD1 23.22,55.37 28.22,55.37 28.46,55.12 U1.14
USART2_TX  (via drill 0.25 pad 0.55)
  Top 0.203: v25.35,54.69 23.89,54.69 U$1.PAD_PU1
  Bottom 0.203: v25.35,54.69 25.49,54.56 27.71,54.56 U1.13
USART5_RX
  Bottom 0.203: U1.40 31.96,47.19 35.56,43.58 40.66,43.58 40.68,43.6 41.14,43.6 41.67,44.12 43.38,44.12 U$1.PAD_PD8
USART5_TX  (via drill 0.25 pad 0.55)
  Top 0.203: U$1.PAD_PU8 41.71,43.2 v41.66,43.25
  Bottom 0.203: U1.41 31.46,47.18 35.42,43.23 40.81,43.23 40.82,43.25 v41.66,43.25
USART6_RX  (via drill 0.25 pad 0.55)
  Top 0.203: v22.97,46.35 26.97,46.35 v27.13,46.51
  Bottom 0.203: U$1.PAD_PD3 19.9,43.27 v22.97,46.35 | v27.13,46.51 27.96,47.33 U1.48
USART6_TX  (via drill 0.25 pad 0.55)
  Top 0.203: U$1.PAD_PU3 16.09,43.64 23.32,43.64 23.47,43.79 23.47,44.91 24.49,45.92 28.28,45.92 v28.38,46.03
  Bottom 0.203: v28.38,46.03 28.46,46.11 U1.47
VDD  (via drill 0.35 pad 0.75)
  Top 0.178: U$1.PAD_PU12 30.63,59.8 31.26,59.17
  Top 0.305: R7.1 20.08,44.44 15.47,49.05 15.47,51.31 U$1.PAD_PU17 | 44.07,51.77 40.51,48.21 39,48.21 37.67,46.88 R9.2
  Top 0.813: U$1.PAD_PU19 44.07,51.77 42.47,52.7 36.72,52.7 36.53,52.51 35.84,52.51 35.64,52.7 35,52.7 34.05,53.65 34.05,57.3 33.43,57.91 31.26,59.17 30.76,59.45 30.17,59.8 29.83,59.8 26.93,58.12 26.19,57.38 26.19,54.35 24.7,52.86 17.81,52.86 15.93,51.77 U$1.PAD_PU17
  Bottom 0.406: FB1.1 26.1,42.81 D2.1 25.3,40.79 23.09,40.79 22.72,41.16 R7.1
  other vias: 22.72,44.44
VDDA
  Bottom 0.305: C7.1 26.5,50.18 U1.4 U1.5 U1.6
  Bottom 0.406: FB1.2 25.95,45.84 C3.1 26,46.61 25.95,46.66 25.95,47.27 C2.1 25.85,47.48 C8.1 C7.1
VSSA
  Bottom 0.254: U1.7 26.99,51.68 26.45,51.14 26.45,50.86 26.29,50.7 26.02,50.7 25.62,50.3 25.18,50.3 24.4,49.52 C7.2
  Bottom 0.406: C7.2 C8.2 24.15,47.37 C2.2 C3.2 24.2,45.79 R3.2
ZC_DETECT  (via drill 0.3 pad 0.6)
  Top 0.254: 24.5,43.17 24.42,43.25 R7.2 C13.1 26.45,45.47 28.61,45.47 29.01,45.87 v29.12,45.87
  Top 0.61: U4.6 24.5,43.17
  Bottom 0.254: v29.12,45.87 28.96,46.03 U1.46

### Text on the board
tPlace: 3V3 | P2* | P3* | 3V3 | 3V3 | R | P1 | P4 | N | L | L | 220V/10A (RMS) | N
bPlace: GND | P2* | P3* | GND | GND | P1 | P4 | H0FR80
tNames: D | C | B